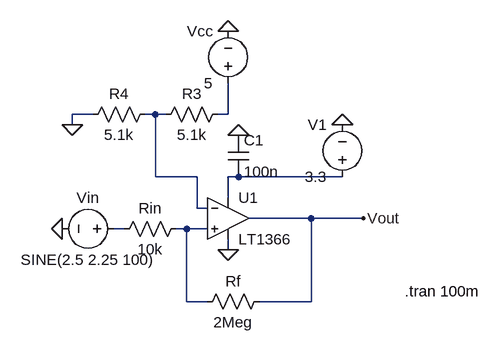
[diagram p0: schematic summer project - magnetism schmitt trigger (final).asc]
summer project - magnetism schmitt trigger (final).asc, the LTspice schematic file:
Version 4.1
SHEET 1 880 680
WIRE -32 -16 -64 -16
WIRE 64 -16 48 -16
WIRE 80 -16 64 -16
WIRE 176 -16 176 -64
WIRE 176 -16 160 -16
WIRE -64 0 -64 -16
WIRE 64 80 64 -16
WIRE 128 80 64 80
WIRE 192 80 176 80
WIRE 352 80 192 80
WIRE 176 112 176 80
WIRE 128 128 128 80
WIRE 144 128 128 128
WIRE 304 144 208 144
WIRE 384 144 304 144
WIRE 16 160 0 160
WIRE 112 160 96 160
WIRE 144 160 112 160
WIRE 176 192 176 176
WIRE 112 272 112 160
WIRE 144 272 112 272
WIRE 304 272 304 144
WIRE 304 272 224 272
FLAG -80 160 0
FLAG 176 192 0
FLAG 176 -144 0
FLAG -64 0 0
FLAG 384 144 Vout
FLAG 352 0 0
FLAG 192 16 0
SYMBOL OpAmps\\LT1366 176 80 R0
SYMATTR InstName U1
SYMBOL voltage 16 160 R90
WINDOW 0 -32 56 VBottom 2
WINDOW 3 32 56 VTop 2
WINDOW 123 0 0 Left 0
WINDOW 39 0 0 Left 0
SYMATTR InstName Vin
SYMATTR Value SINE(2.5 2.25 100)
SYMBOL voltage 176 -48 R180
WINDOW 0 24 96 Left 2
WINDOW 3 24 16 Left 2
WINDOW 123 0 0 Left 0
WINDOW 39 0 0 Left 0
SYMATTR InstName Vcc
SYMATTR Value 5
SYMBOL res 112 144 R90
WINDOW 0 0 56 VBottom 2
WINDOW 3 32 56 VTop 2
SYMATTR InstName Rin
SYMATTR Value 10k
SYMBOL res 240 256 R90
WINDOW 0 0 56 VBottom 2
WINDOW 3 32 56 VTop 2
SYMATTR InstName Rf
SYMATTR Value 2Meg
SYMBOL res 176 -32 R90
WINDOW 0 0 56 VBottom 2
WINDOW 3 32 56 VTop 2
SYMATTR InstName R3
SYMATTR Value 5.1k
SYMBOL res 64 -32 R90
WINDOW 0 0 56 VBottom 2
WINDOW 3 32 56 VTop 2
SYMATTR InstName R4
SYMATTR Value 5.1k
SYMBOL voltage 352 96 R180
WINDOW 0 24 96 Left 2
WINDOW 3 24 16 Left 2
WINDOW 123 0 0 Left 0
WINDOW 39 0 0 Left 0
SYMATTR InstName V1
SYMATTR Value 3.3
SYMBOL cap 176 16 R0
SYMATTR InstName C1
SYMATTR Value 100n
TEXT 448 256 Left 2 !.tran 100m

The netlist it stands for:
* summer project - magnetism schmitt trigger (final).asc
X§U1 N005 N001 N003 0 Vout LT1366  ; pins In+ In- V+ V- OUT
Vin N004 0 SINE(2.5 2.25 100)
Vcc N002 0 5
Rin N005 N004 10k
Rf Vout N005 2Meg
R3 N002 N001 5.1k
R4 N001 0 5.1k
V1 N003 0 3.3
C1 0 N003 100n
.tran 100m
.lib LTC.lib
.backanno
.end